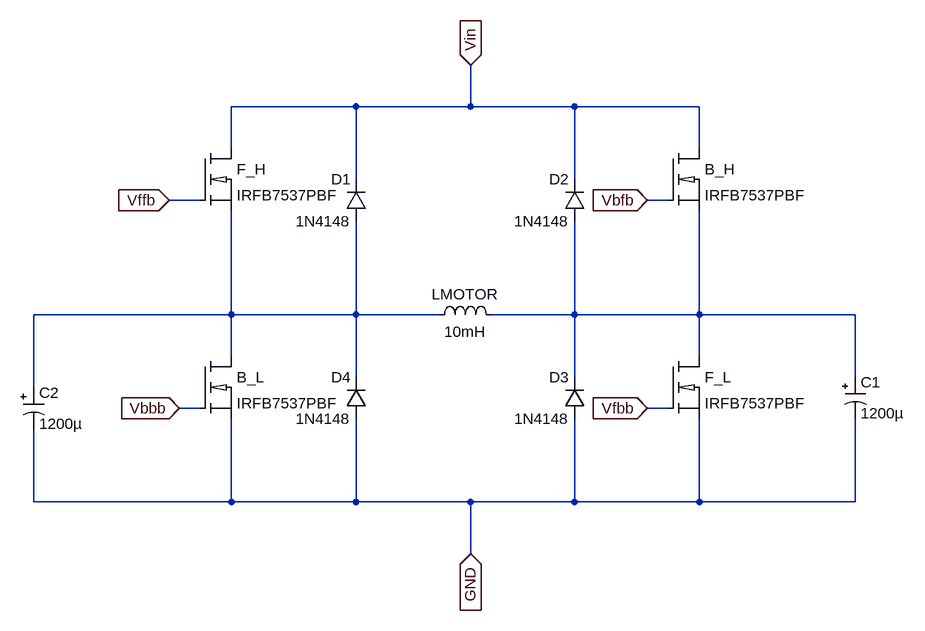
[diagram p0: schematic NMOSFullBridge.asc]
NMOSFullBridge.asc, the LTspice schematic file:
Version 4
SHEET 1 2712 2204
WIRE 1664 -576 1472 -576
WIRE 1840 -576 1840 -640
WIRE 1840 -576 1664 -576
WIRE 2000 -576 1840 -576
WIRE 2192 -576 2000 -576
WIRE 1472 -512 1472 -576
WIRE 2192 -512 2192 -576
WIRE 1664 -464 1664 -576
WIRE 2000 -464 2000 -576
WIRE 1424 -432 1376 -432
WIRE 2144 -432 2112 -432
WIRE 1472 -256 1472 -416
WIRE 1472 -256 1168 -256
WIRE 1664 -256 1664 -400
WIRE 1664 -256 1472 -256
WIRE 1792 -256 1664 -256
WIRE 2000 -256 2000 -400
WIRE 2000 -256 1872 -256
WIRE 2192 -256 2192 -416
WIRE 2192 -256 2000 -256
WIRE 2432 -256 2192 -256
WIRE 1472 -192 1472 -256
WIRE 2192 -192 2192 -256
WIRE 1664 -160 1664 -256
WIRE 2000 -160 2000 -256
WIRE 2432 -160 2432 -256
WIRE 1168 -144 1168 -256
WIRE 1424 -112 1392 -112
WIRE 2144 -112 2112 -112
WIRE 1168 32 1168 -80
WIRE 1472 32 1472 -96
WIRE 1472 32 1168 32
WIRE 1664 32 1664 -96
WIRE 1664 32 1472 32
WIRE 1840 32 1664 32
WIRE 2000 32 2000 -96
WIRE 2000 32 1840 32
WIRE 2192 32 2192 -96
WIRE 2192 32 2000 32
WIRE 2432 32 2432 -96
WIRE 2432 32 2192 32
WIRE 1840 112 1840 32
FLAG 1840 -640 Vin
IOPIN 1840 -640 In
FLAG 1376 -432 Vffb
IOPIN 1376 -432 In
FLAG 2112 -432 Vbfb
IOPIN 2112 -432 In
FLAG 2112 -112 Vfbb
IOPIN 2112 -112 In
FLAG 1392 -112 Vbbb
IOPIN 1392 -112 In
FLAG 1840 112 GND
IOPIN 1840 112 In
SYMBOL ind 1776 -240 R270
WINDOW 0 32 56 VTop 2
WINDOW 3 5 56 VBottom 2
SYMATTR InstName LMOTOR
SYMATTR Value 10mH
SYMATTR SpiceLine Ipk=173 Rser=2.5 Rpar=2.5 Cpar=0
SYMBOL IRFB7537PBF 1424 -512 R0
SYMATTR InstName F_H
SYMBOL IRFB7537PBF 1424 -192 R0
SYMATTR InstName B_L
SYMBOL IRFB7537PBF 2144 -512 R0
SYMATTR InstName B_H
SYMBOL IRFB7537PBF 2144 -192 R0
SYMATTR InstName F_L
SYMBOL diode 1680 -400 R180
WINDOW 0 24 64 Left 2
WINDOW 3 24 0 Left 2
SYMATTR InstName D1
SYMATTR Value 1N4148
SYMBOL diode 2016 -400 R180
WINDOW 0 24 64 Left 2
WINDOW 3 24 0 Left 2
SYMATTR InstName D2
SYMATTR Value 1N4148
SYMBOL diode 2016 -96 R180
WINDOW 0 24 64 Left 2
WINDOW 3 24 0 Left 2
SYMATTR InstName D3
SYMATTR Value 1N4148
SYMBOL diode 1680 -96 R180
WINDOW 0 24 64 Left 2
WINDOW 3 24 0 Left 2
SYMATTR InstName D4
SYMATTR Value 1N4148
SYMBOL polcap 2416 -160 R0
WINDOW 3 24 56 Left 2
SYMATTR Value 1200µ
SYMATTR InstName C1
SYMATTR Description Capacitor
SYMATTR Type cap
SYMATTR SpiceLine V=35 Irms=2.22 Rser=0.024 Lser=0 mfg="United Chemi-Con" pn="LXF35VB122M12X35LL" type="Al electrolytic"
SYMBOL polcap 1152 -144 R0
WINDOW 3 24 56 Left 2
SYMATTR Value 1200µ
SYMATTR InstName C2
SYMATTR Description Capacitor
SYMATTR Type cap
SYMATTR SpiceLine V=35 Irms=2.22 Rser=0.024 Lser=0 mfg="United Chemi-Con" pn="LXF35VB122M12X35LL" type="Al electrolytic"

The netlist it stands for:
* NMOSFullBridge.asc
LMOTOR N001 N002 10mH Ipk=173 Rser=2.5 Rpar=2.5 Cpar=0
XF_H Vin Vffb N001 IRFB7537PBF  ; pins D G S
XB_L N001 Vbbb GND IRFB7537PBF  ; pins D G S
XB_H Vin Vbfb N002 IRFB7537PBF  ; pins D G S
XF_L N002 Vfbb GND IRFB7537PBF  ; pins D G S
D1 N001 Vin 1N4148
D2 N002 Vin 1N4148
D3 GND N002 1N4148
D4 GND N001 1N4148
C1 N002 GND 1200µ V=35 Irms=2.22 Rser=0.024 Lser=0 mfg="United Chemi-Con" pn="LXF35VB122M12X35LL" type="Al electrolytic"
C2 N001 GND 1200µ V=35 Irms=2.22 Rser=0.024 Lser=0 mfg="United Chemi-Con" pn="LXF35VB122M12X35LL" type="Al electrolytic"
.model D D
.lib standard.dio
.lib .\IRFB7537PBF.cir
.backanno
.end